# EasyEDA schematic SCH_Cocktail-Hat-Screw-Terminals_2026-04-29.json

## Sheets
1 Main: TITLE: Cocktail Hat - Screw Terminals; REV: 1.0; Date: 2026-04-29; Sheet: 1/2; Drawn By: Gidget19893161
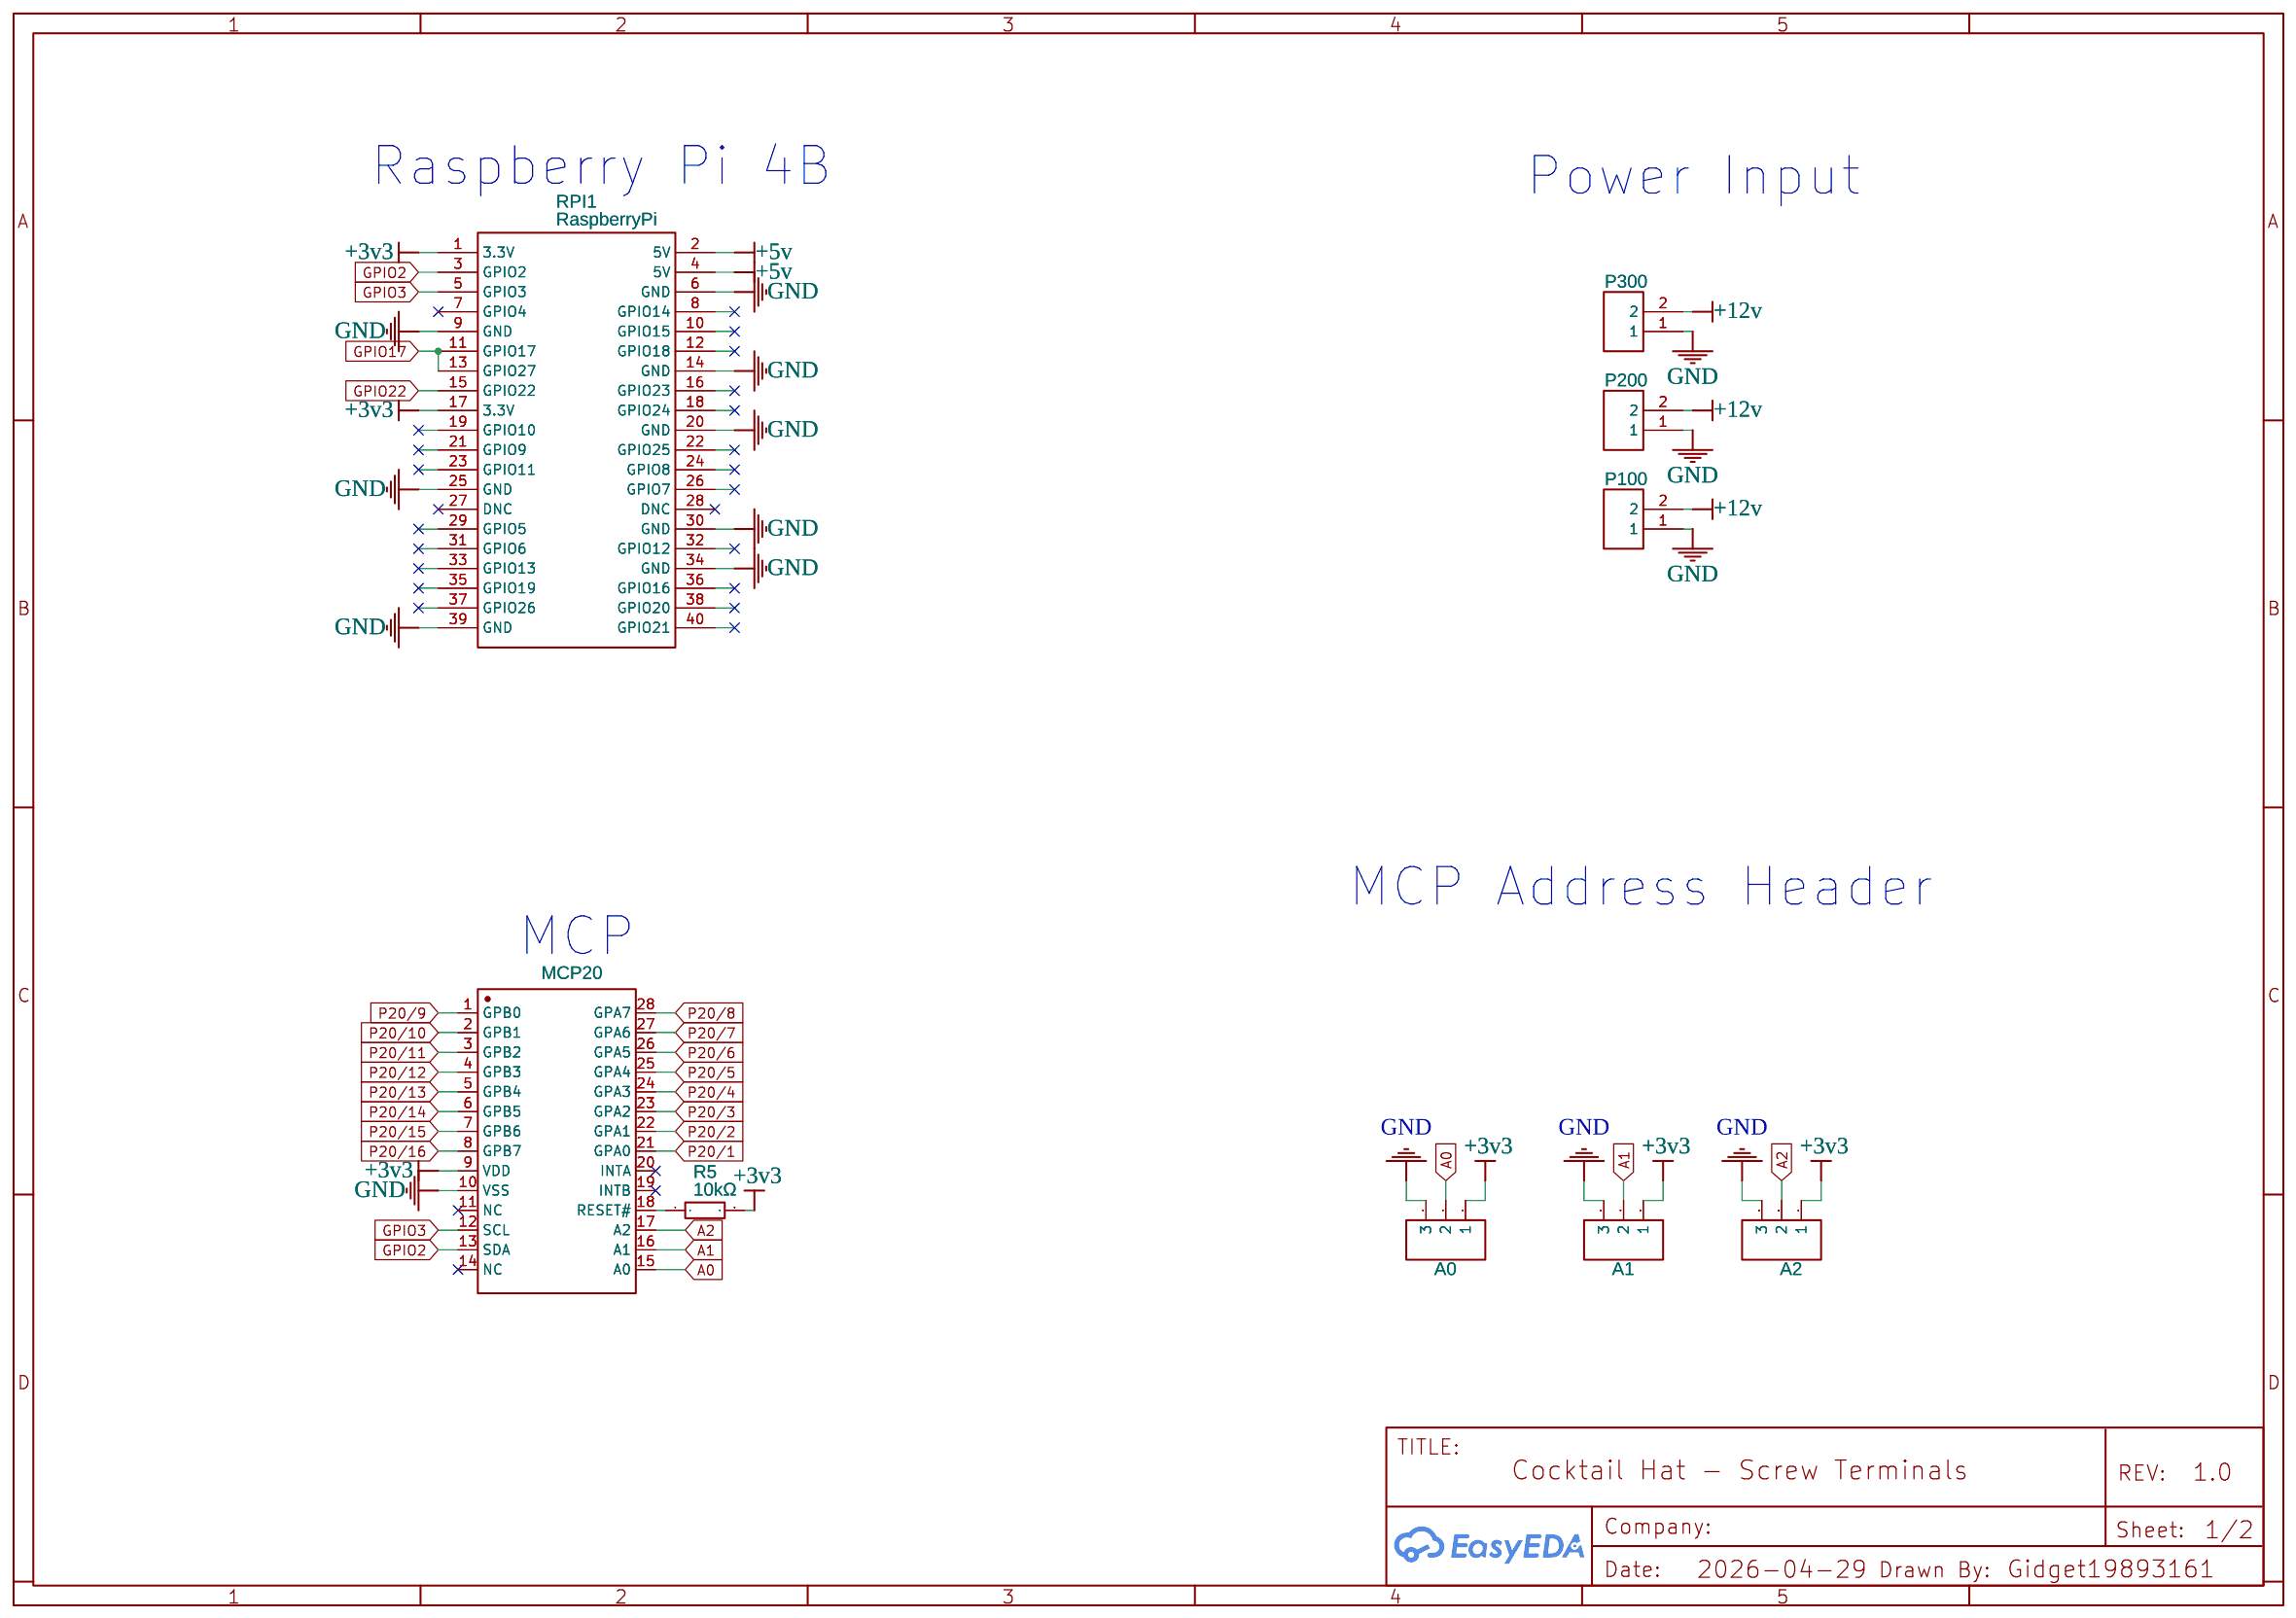
[diagram p0: Main]
2 TB20: Sheet: 2/2
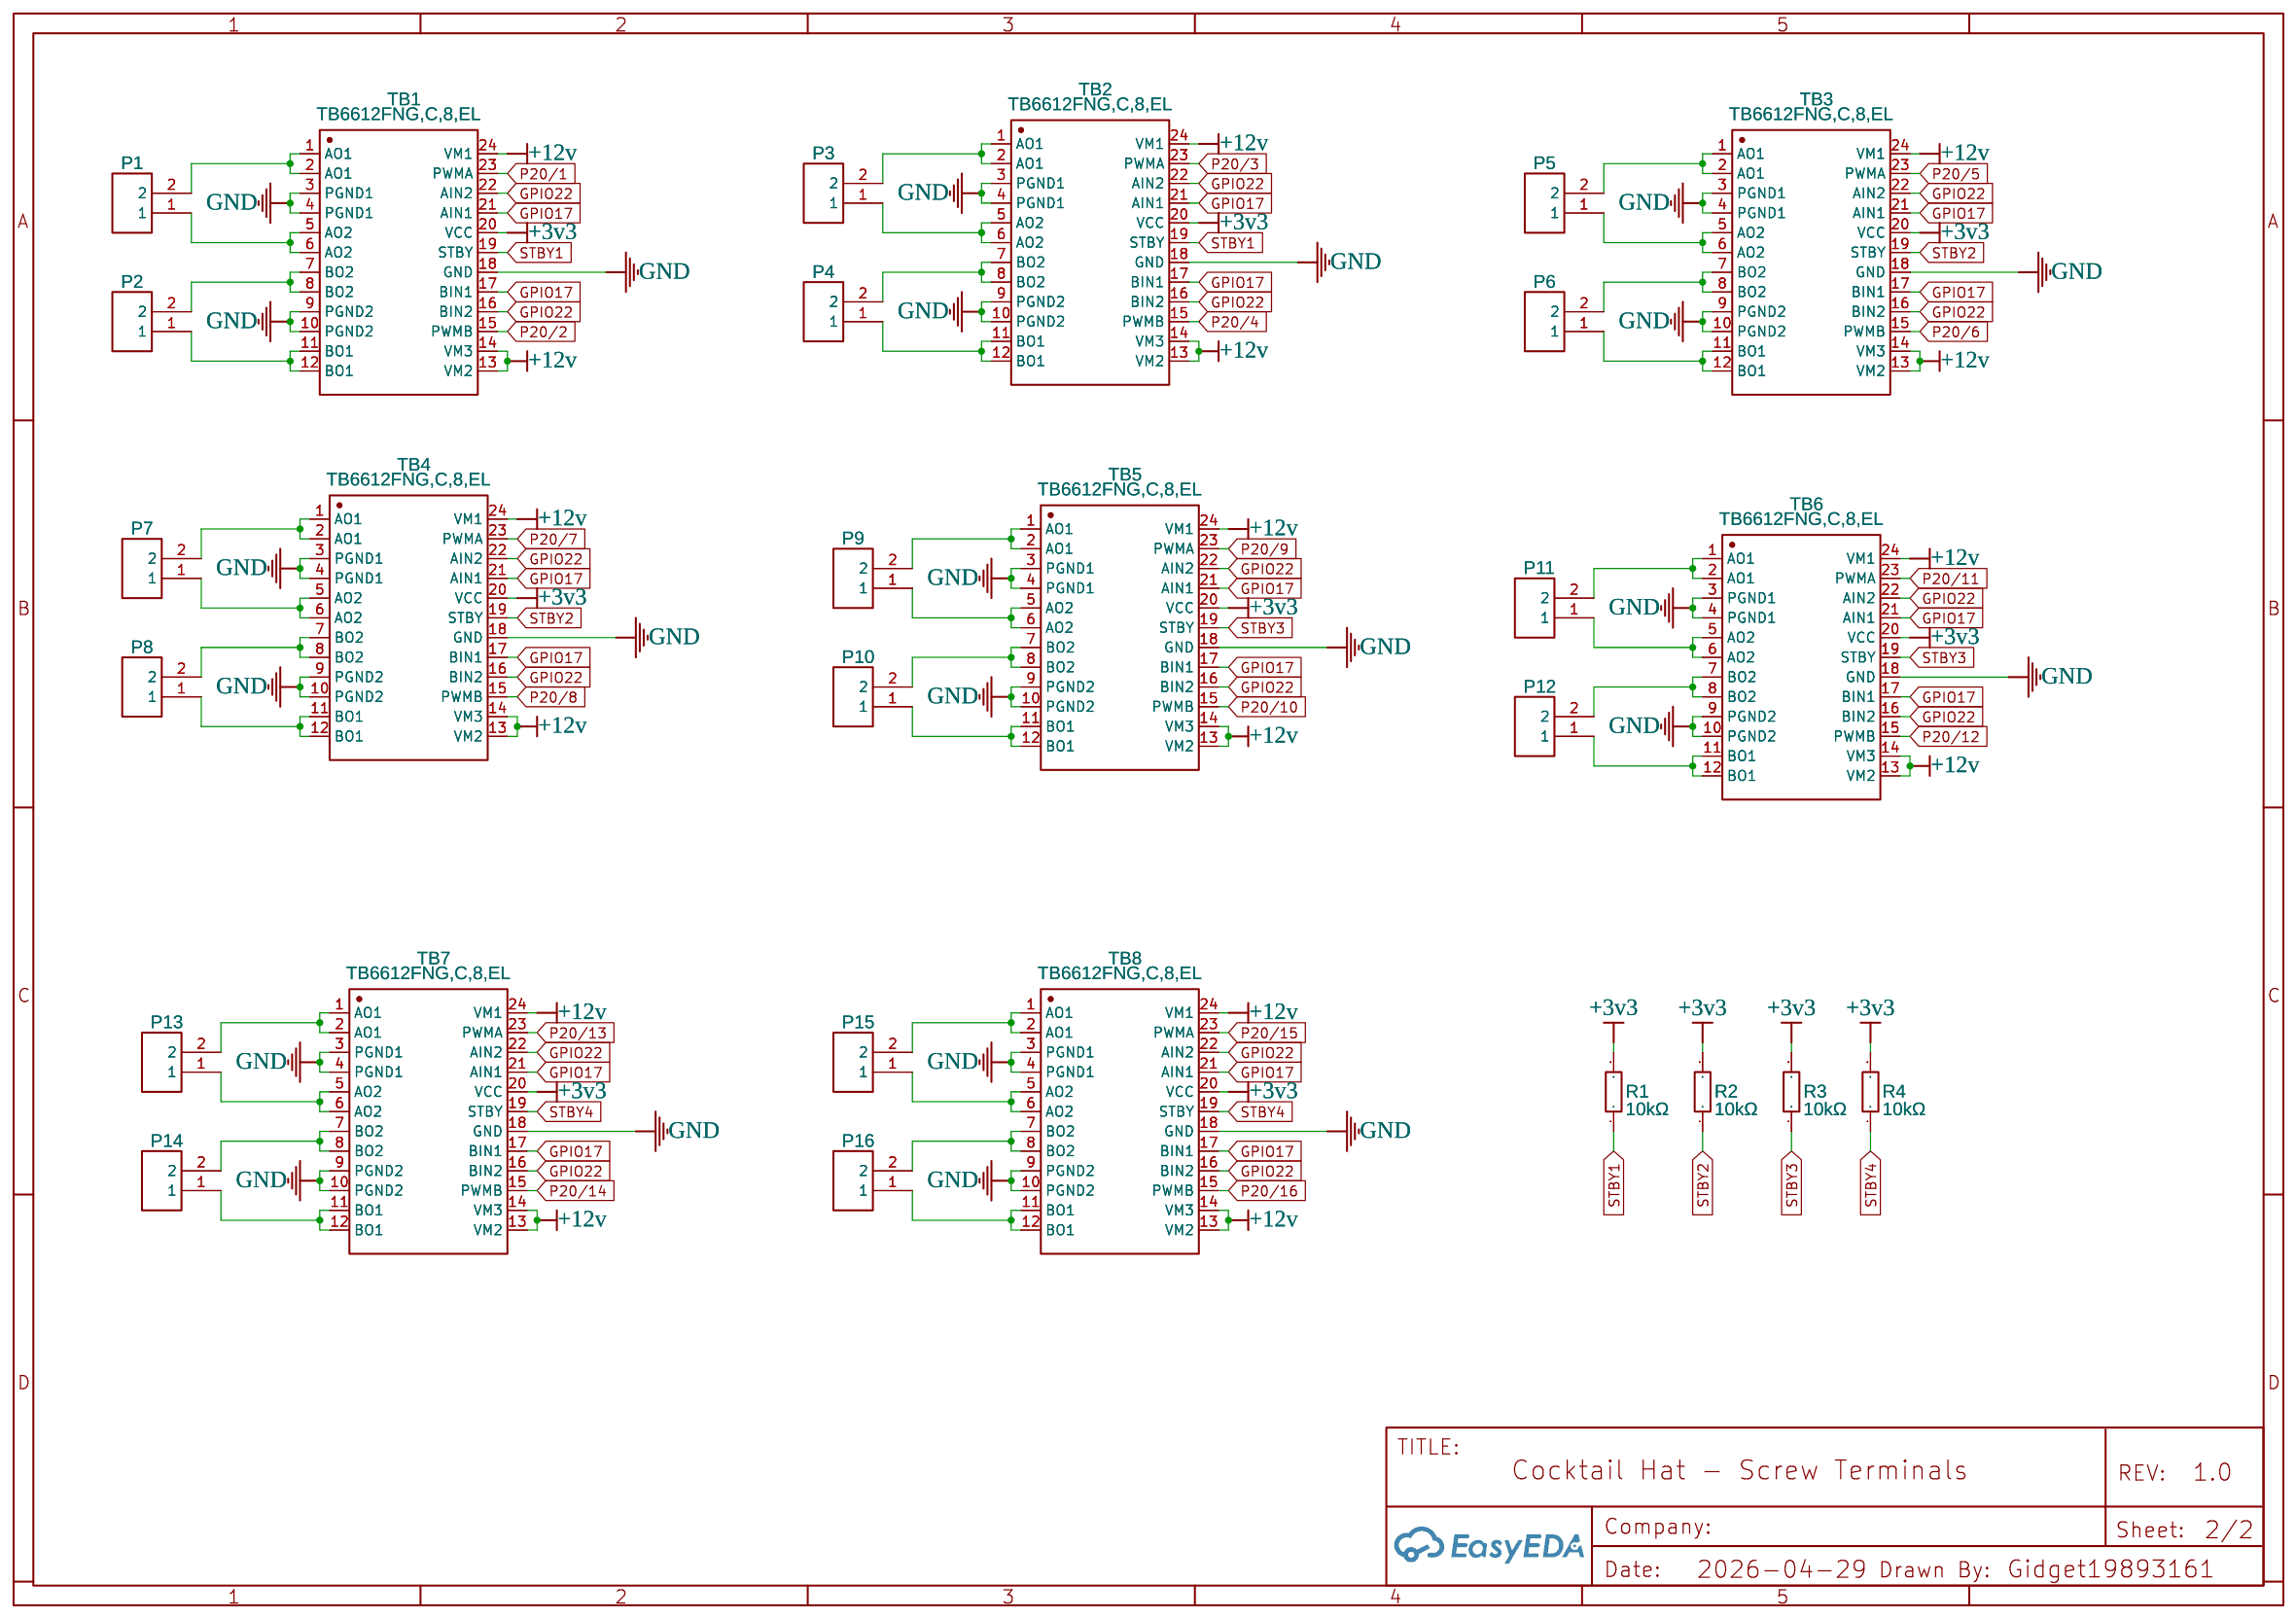
[diagram p1: TB20]

## Parts
sheet Main
A0  Header-Male-2.54_1x3  [HDR-TH_3P-P2.54-V-M-1]
A1  Header-Male-2.54_1x3  [HDR-TH_3P-P2.54-V-M-1]
A2  Header-Male-2.54_1x3  [HDR-TH_3P-P2.54-V-M-1]
MCP20  MCP23017-E/SO  [SOIC-28_L18.0-W7.5-P1.27-LS10.3-BL]
P100  WJ500V-5.08-2P-14-00A  [CONN-TH_2P-P5.00_WJ500V-5.08-2P]
P200  WJ500V-5.08-2P-14-00A  [CONN-TH_2P-P5.00_WJ500V-5.08-2P]
P300  WJ500V-5.08-2P-14-00A  [CONN-TH_2P-P5.00_WJ500V-5.08-2P]
R5  10kΩ  [R1206]
RPI1  RaspberryPi  [RASPBERRYPI]
sheet TB20
P1  WJ500V-5.08-2P-14-00A  [CONN-TH_2P-P5.00_WJ500V-5.08-2P]
P2  WJ500V-5.08-2P-14-00A  [CONN-TH_2P-P5.00_WJ500V-5.08-2P]
P3  WJ500V-5.08-2P-14-00A  [CONN-TH_2P-P5.00_WJ500V-5.08-2P]
P4  WJ500V-5.08-2P-14-00A  [CONN-TH_2P-P5.00_WJ500V-5.08-2P]
P5  WJ500V-5.08-2P-14-00A  [CONN-TH_2P-P5.00_WJ500V-5.08-2P]
P6  WJ500V-5.08-2P-14-00A  [CONN-TH_2P-P5.00_WJ500V-5.08-2P]
P7  WJ500V-5.08-2P-14-00A  [CONN-TH_2P-P5.00_WJ500V-5.08-2P]
P8  WJ500V-5.08-2P-14-00A  [CONN-TH_2P-P5.00_WJ500V-5.08-2P]
P9  WJ500V-5.08-2P-14-00A  [CONN-TH_2P-P5.00_WJ500V-5.08-2P]
P10  WJ500V-5.08-2P-14-00A  [CONN-TH_2P-P5.00_WJ500V-5.08-2P]
P11  WJ500V-5.08-2P-14-00A  [CONN-TH_2P-P5.00_WJ500V-5.08-2P]
P12  WJ500V-5.08-2P-14-00A  [CONN-TH_2P-P5.00_WJ500V-5.08-2P]
P13  WJ500V-5.08-2P-14-00A  [CONN-TH_2P-P5.00_WJ500V-5.08-2P]
P14  WJ500V-5.08-2P-14-00A  [CONN-TH_2P-P5.00_WJ500V-5.08-2P]
P15  WJ500V-5.08-2P-14-00A  [CONN-TH_2P-P5.00_WJ500V-5.08-2P]
P16  WJ500V-5.08-2P-14-00A  [CONN-TH_2P-P5.00_WJ500V-5.08-2P]
R1  10kΩ  [R1206]
R2  10kΩ  [R1206]
R3  10kΩ  [R1206]
R4  10kΩ  [R1206]
TB1  TB6612FNG,C,8,EL  [SSOP-24_L8.3-W5.6-P0.65-LS7.6-BL]
TB2  TB6612FNG,C,8,EL  [SSOP-24_L8.3-W5.6-P0.65-LS7.6-BL]
TB3  TB6612FNG,C,8,EL  [SSOP-24_L8.3-W5.6-P0.65-LS7.6-BL]
TB4  TB6612FNG,C,8,EL  [SSOP-24_L8.3-W5.6-P0.65-LS7.6-BL]
TB5  TB6612FNG,C,8,EL  [SSOP-24_L8.3-W5.6-P0.65-LS7.6-BL]
TB6  TB6612FNG,C,8,EL  [SSOP-24_L8.3-W5.6-P0.65-LS7.6-BL]
TB7  TB6612FNG,C,8,EL  [SSOP-24_L8.3-W5.6-P0.65-LS7.6-BL]
TB8  TB6612FNG,C,8,EL  [SSOP-24_L8.3-W5.6-P0.65-LS7.6-BL]

## Library data of the parts
A0-A2 = Header-Male-2.54_1x3: Supplier: LCSC; Manufacturer: BOOMELE(博穆精密); Manufacturer Part: 2.54-1*3P针; Supplier Part: C49257; JLCPCB Part Class: Extended Part
MCP20 = MCP23017-E/SO: Contributor: LCSC; Supplier: LCSC; Manufacturer: MICROCHIP(美国微芯); Supplier Part: C47023; JLCPCB Part Class: Extended Part
P1-P16 P100 P200 P300 = WJ500V-5.08-2P-14-00A: Supplier: LCSC; Manufacturer: KANGNEX(康奈克斯电气); Manufacturer Part: WJ500V-5.08-2P; Supplier Part: C8465; JLCPCB Part Class: Extended Part
R1-R5 = 1206W4F1002T5E: Supplier: LCSC; Manufacturer: UNI-ROYAL(厚声); Supplier Part: C17902; JLCPCB Part Class: Basic Part
RPI1 = RaspberryPi: Contributor: DeathsDead; Package Display: No
TB1-TB8 = TB6612FNG,C,8,EL: Contributor: LCSC; Supplier: LCSC; Manufacturer: TOSHIBA(东芝); Supplier Part: C141517; JLCPCB Part Class: Extended Part

## Nets
+3v3: A0.1 A1.1 A2.1 MCP20.9(VDD) R1.2 R2.2 R3.2 R4.2 R5.2 RPI1.1(3.3V) RPI1.17(3.3V) TB1.20(VCC) TB2.20(VCC) TB3.20(VCC) TB4.20(VCC) TB5.20(VCC) TB6.20(VCC) TB7.20(VCC) TB8.20(VCC)
+5v: RPI1.2(5V) RPI1.4(5V)
+12v: P100.2 P200.2 P300.2 TB1.13(VM2) TB1.14(VM3) TB1.24(VM1) TB2.13(VM2) TB2.14(VM3) TB2.24(VM1) TB3.13(VM2) TB3.14(VM3) TB3.24(VM1) TB4.13(VM2) TB4.14(VM3) TB4.24(VM1) TB5.13(VM2) TB5.14(VM3) TB5.24(VM1) TB6.13(VM2) TB6.14(VM3) TB6.24(VM1) TB7.13(VM2) TB7.14(VM3) TB7.24(VM1) TB8.13(VM2) TB8.14(VM3) TB8.24(VM1)
GND: A0.3 A1.3 A2.3 MCP20.10(VSS) P100.1 P200.1 P300.1 RPI1.6(GND) RPI1.9(GND) RPI1.14(GND) RPI1.20(GND) RPI1.25(GND) RPI1.30(GND) RPI1.34(GND) RPI1.39(GND) TB1.3(PGND1) TB1.4(PGND1) TB1.9(PGND2) TB1.10(PGND2) TB1.18(GND) TB2.3(PGND1) TB2.4(PGND1) TB2.9(PGND2) TB2.10(PGND2) TB2.18(GND) TB3.3(PGND1) TB3.4(PGND1) TB3.9(PGND2) TB3.10(PGND2) TB3.18(GND) TB4.3(PGND1) TB4.4(PGND1) TB4.9(PGND2) TB4.10(PGND2) TB4.18(GND) TB5.3(PGND1) TB5.4(PGND1) TB5.9(PGND2) TB5.10(PGND2) TB5.18(GND) TB6.3(PGND1) TB6.4(PGND1) TB6.9(PGND2) TB6.10(PGND2) TB6.18(GND) TB7.3(PGND1) TB7.4(PGND1) TB7.9(PGND2) TB7.10(PGND2) TB7.18(GND) TB8.3(PGND1) TB8.4(PGND1) TB8.9(PGND2) TB8.10(PGND2) TB8.18(GND)
A0: A0.2 MCP20.15(A0)
A1: A1.2 MCP20.16(A1)
A2: A2.2 MCP20.17(A2)
GPIO2: MCP20.13(SDA) RPI1.3(GPIO2)
GPIO3: MCP20.12(SCL) RPI1.5(GPIO3)
GPIO17: RPI1.11(GPIO17) RPI1.13(GPIO27) TB1.17(BIN1) TB1.21(AIN1) TB2.17(BIN1) TB2.21(AIN1) TB3.17(BIN1) TB3.21(AIN1) TB4.17(BIN1) TB4.21(AIN1) TB5.17(BIN1) TB5.21(AIN1) TB6.17(BIN1) TB6.21(AIN1) TB7.17(BIN1) TB7.21(AIN1) TB8.17(BIN1) TB8.21(AIN1)
GPIO22: RPI1.15(GPIO22) TB1.16(BIN2) TB1.22(AIN2) TB2.16(BIN2) TB2.22(AIN2) TB3.16(BIN2) TB3.22(AIN2) TB4.16(BIN2) TB4.22(AIN2) TB5.16(BIN2) TB5.22(AIN2) TB6.16(BIN2) TB6.22(AIN2) TB7.16(BIN2) TB7.22(AIN2) TB8.16(BIN2) TB8.22(AIN2)
P20/1: MCP20.21(GPA0) TB1.23(PWMA)
P20/2: MCP20.22(GPA1) TB1.15(PWMB)
P20/3: MCP20.23(GPA2) TB2.23(PWMA)
P20/4: MCP20.24(GPA3) TB2.15(PWMB)
P20/5: MCP20.25(GPA4) TB3.23(PWMA)
P20/6: MCP20.26(GPA5) TB3.15(PWMB)
P20/7: MCP20.27(GPA6) TB4.23(PWMA)
P20/8: MCP20.28(GPA7) TB4.15(PWMB)
P20/9: MCP20.1(GPB0) TB5.23(PWMA)
P20/10: MCP20.2(GPB1) TB5.15(PWMB)
P20/11: MCP20.3(GPB2) TB6.23(PWMA)
P20/12: MCP20.4(GPB3) TB6.15(PWMB)
P20/13: MCP20.5(GPB4) TB7.23(PWMA)
P20/14: MCP20.6(GPB5) TB7.15(PWMB)
P20/15: MCP20.7(GPB6) TB8.23(PWMA)
P20/16: MCP20.8(GPB7) TB8.15(PWMB)
STBY1: R1.1 TB1.19(STBY) TB2.19(STBY)
STBY2: R2.1 TB3.19(STBY) TB4.19(STBY)
STBY3: R3.1 TB5.19(STBY) TB6.19(STBY)
STBY4: R4.1 TB7.19(STBY) TB8.19(STBY)
Net-(MCP20-18): MCP20.18(RESET#) R5.1
Net-(P1-1): P1.1 TB1.5(AO2) TB1.6(AO2)
Net-(P1-2): P1.2 TB1.1(AO1) TB1.2(AO1)
Net-(P2-1): P2.1 TB1.11(BO1) TB1.12(BO1)
Net-(P2-2): P2.2 TB1.7(BO2) TB1.8(BO2)
Net-(P3-1): P3.1 TB2.5(AO2) TB2.6(AO2)
Net-(P3-2): P3.2 TB2.1(AO1) TB2.2(AO1)
Net-(P4-1): P4.1 TB2.11(BO1) TB2.12(BO1)
Net-(P4-2): P4.2 TB2.7(BO2) TB2.8(BO2)
Net-(P5-1): P5.1 TB3.5(AO2) TB3.6(AO2)
Net-(P5-2): P5.2 TB3.1(AO1) TB3.2(AO1)
Net-(P6-1): P6.1 TB3.11(BO1) TB3.12(BO1)
Net-(P6-2): P6.2 TB3.7(BO2) TB3.8(BO2)
Net-(P7-1): P7.1 TB4.5(AO2) TB4.6(AO2)
Net-(P7-2): P7.2 TB4.1(AO1) TB4.2(AO1)
Net-(P8-1): P8.1 TB4.11(BO1) TB4.12(BO1)
Net-(P8-2): P8.2 TB4.7(BO2) TB4.8(BO2)
Net-(P9-1): P9.1 TB5.5(AO2) TB5.6(AO2)
Net-(P9-2): P9.2 TB5.1(AO1) TB5.2(AO1)
Net-(P10-1): P10.1 TB5.11(BO1) TB5.12(BO1)
Net-(P10-2): P10.2 TB5.7(BO2) TB5.8(BO2)
Net-(P11-1): P11.1 TB6.5(AO2) TB6.6(AO2)
Net-(P11-2): P11.2 TB6.1(AO1) TB6.2(AO1)
Net-(P12-1): P12.1 TB6.11(BO1) TB6.12(BO1)
Net-(P12-2): P12.2 TB6.7(BO2) TB6.8(BO2)
Net-(P13-1): P13.1 TB7.5(AO2) TB7.6(AO2)
Net-(P13-2): P13.2 TB7.1(AO1) TB7.2(AO1)
Net-(P14-1): P14.1 TB7.11(BO1) TB7.12(BO1)
Net-(P14-2): P14.2 TB7.7(BO2) TB7.8(BO2)
Net-(P15-1): P15.1 TB8.5(AO2) TB8.6(AO2)
Net-(P15-2): P15.2 TB8.1(AO1) TB8.2(AO1)
Net-(P16-1): P16.1 TB8.11(BO1) TB8.12(BO1)
Net-(P16-2): P16.2 TB8.7(BO2) TB8.8(BO2)

Not connected (* = marked no-connect by the designer): MCP20 11(NC)* 14(NC)* 19(INTB)* 20(INTA)*; RPI1 7(GPIO4)* 8(GPIO14) 10(GPIO15) 12(GPIO18) 16(GPIO23) 18(GPIO24) 19(GPIO10) 21(GPIO9) 22(GPIO25) 23(GPIO11) 24(GPIO8) 26(GPIO7) 27(DNC)* 28(DNC)* 29(GPIO5) 31(GPIO6) 32(GPIO12) 33(GPIO13) 35(GPIO19) 36(GPIO16) 37(GPIO26) 38(GPIO20) 40(GPIO21)

## Notes on the sheets
sheet 1
- Raspberry Pi 4B
- Power Input
- MCP Address Header
- MCP
